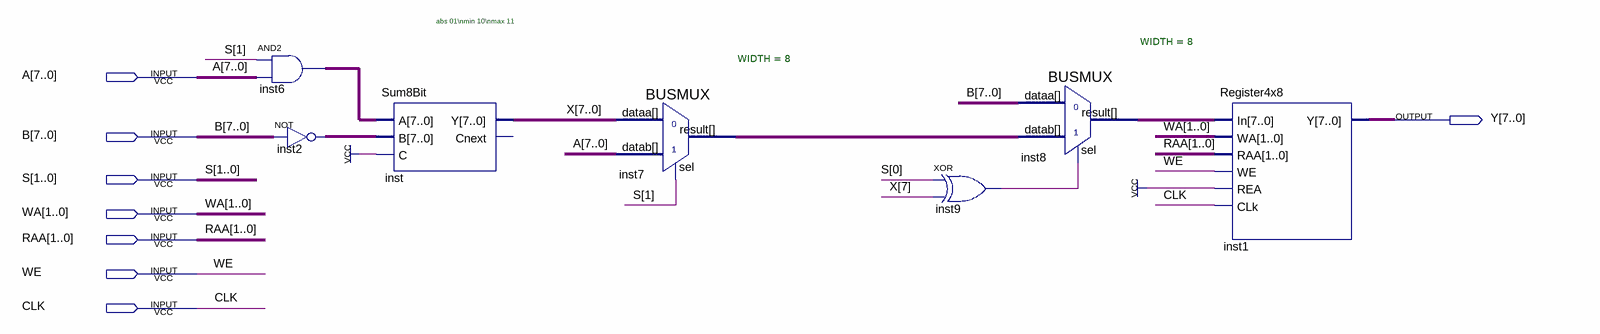
[diagram p0: schematic sheet]
// Quartus schematic AU1.bdf as structural Verilog: 7 symbols, 8 pins
module AU1 (
  input  [7:0] A,
  input  [7:0] B,
  input  [1:0] S,
  input  [1:0] WA,
  input  [1:0] RAA,
  input  WE,
  input  CLK,
  output [7:0] Y
);

  wire inst9_out;
  wire [7:0] inst2_out, inst6_out, inst7_result, inst8_result, X;

  assign inst6_out = {8{S[1]}} & A;  // AND2 inst6, 8 bits wide
  assign inst2_out = ~B;  // NOT inst2, 8 bits wide
  Sum8Bit inst (.A(inst6_out), .B(inst2_out), .C(1'b1), .Y(X));  // open: Cnext
  BUSMUX #(.WIDTH(8)) inst7 (.datab(A), .sel(S[1]), .dataa(X), .result(inst7_result));
  xor inst9 (inst9_out, S[0], X[7]);
  BUSMUX #(.WIDTH(8)) inst8 (.datab(inst7_result), .sel(inst9_out), .dataa(B), .result(inst8_result));
  Register4x8 inst1 (.In(inst8_result), .WA(WA), .RAA(RAA), .WE(WE), .REA(1'b1), .CLk(CLK), .Y(Y));

  // Notes on the sheet:
  //   abs 01\nmin 10\nmax 11
endmodule
